# EAGLE schematic Page1 (EAGLE 9.6.2)
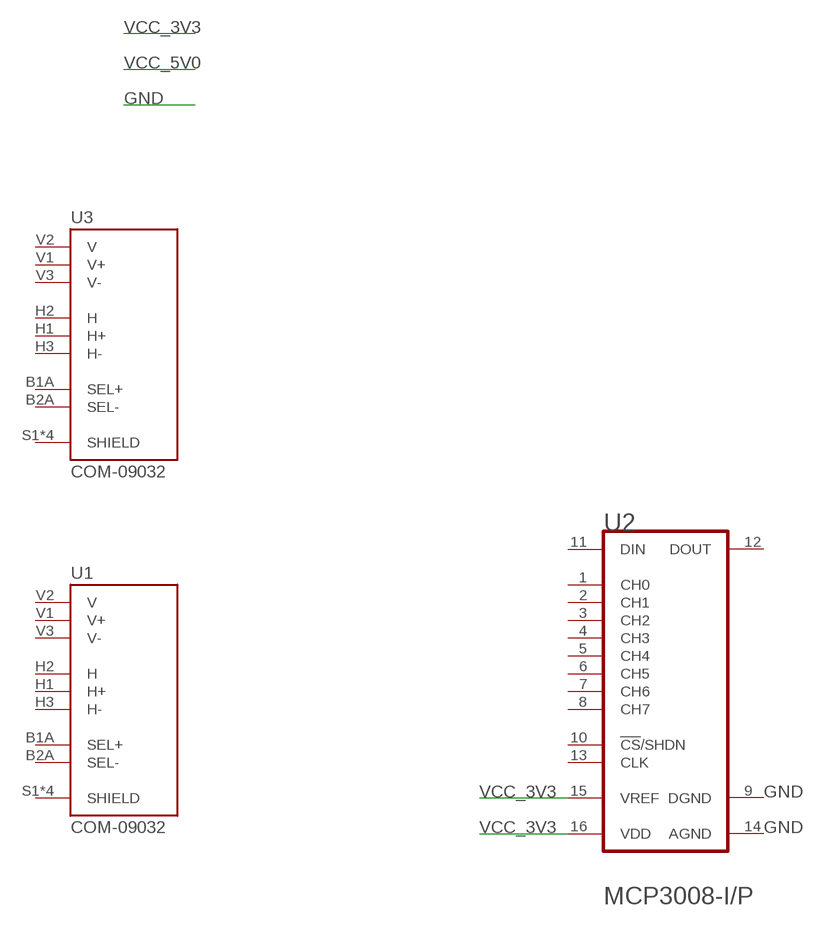
[diagram p0: schematic, sheet 1]

## Parts
U1  COM-09032  [XDCR_COM-09032]
U2  MICROCHIP_MCP3008-I-PMICROCHIP_MCP3008-I-P_0_0  [MICROCHIP_MCP3008-I-P_0]
U3  COM-09032  [XDCR_COM-09032]

## Nets
N$1: U2.15(VREF) U2.16(VDD)
Unconnected: U1.B1A(SEL+) U1.B2A(SEL-) U1.H1(H+) U1.H2(H) U1.H3(H-) U1.S1(SHIELD) U1.S2(SHIELD) U1.S3(SHIELD) U1.S4(SHIELD) U1.V1(V+) U1.V2(V) U1.V3(V-) U2.1(CH0) U2.2(CH1) U2.3(CH2) U2.4(CH3) U2.5(CH4) U2.6(CH5) U2.7(CH6) U2.8(CH7) U2.10(!CS!/SHDN) U2.11(DIN) U2.12(DOUT) U2.13(CLK) U3.B1A(SEL+) U3.B2A(SEL-) U3.H1(H+) U3.H2(H) U3.H3(H-) U3.S1(SHIELD) U3.S2(SHIELD) U3.S3(SHIELD) U3.S4(SHIELD) U3.V1(V+) U3.V2(V) U3.V3(V-)

## Power pins joined to a net without a drawn wire
AGND: U2.14(AGND)
DGND: U2.9(DGND)

## Library data of the parts
U1 U3 = COM-09032:COM-09032: Thumb Joystick Check availability <https://pricing.snapeda.com/parts/COM-09032/SparkFun%20Electronics/view-part?ref=eda>; AVAILABILITY: In Stock; DESCRIPTION: Joystick, 2 - Axis Analog (Resistive) Output; MF: SparkFun Electronics; MP: COM-09032; PACKAGE: SparkFun Electronics; PRICE: None; PURCHASE-URL: https://pricing.snapeda.com/search/part/COM-09032/?ref=eda
U2 = P:MICROCHIP_MCP3008-I-P: CON-ADC-MCP3008-16; CIIVA_IDS: 1029167; CODE__JEDEC: MS-001-BB; COMPONENT_LINK_1_DESCRIPTION: Manufacturer URL; COMPONENT_LINK_1_URL: http://www.microchip.com/; COMPONENT_LINK_3_DESCRIPTION: Package Specification; COMPONENT_LINK_3_URL: http://www.microchip.com/stellent/groups/techpub_sg/documents/packagingspec/en012702.pdf; DATASHEET: http://ww1.microchip.com/downloads/en/DeviceDoc/21295d.pdf; DATASHEET_VERSION: revD, Dec-2008; FOOTPRINT_VARIANT_NAME_0: Manufacturer Recommended; IMPORTED: yes; IMPORTED_FROM: vault; IMPORT_TS: 1521858609; MF: Microchip; MPN: MCP3008-I/P; PACKAGE: PDIP300-P16; PACKAGE_DESCRIPTION: 16-Lead Plastic Dual In-Line (P) - 300 mil Body [PDIP]; PACKAGE_VERSION: revBB, Aug-2009; PIN_0_0_4_INSIDE_EDGE: clock; PREFIX: U; RELEASE_DATE: 1331947901; VAULT_GUID: 2915DD49-D9E5-42B8-8D13-7AC3BE91A6A7; VAULT_REVISION: 766F0992-63B6-4F6C-8EA7-A406CB97F150